# EAGLE design PC060HA (EAGLE 9.6.2)
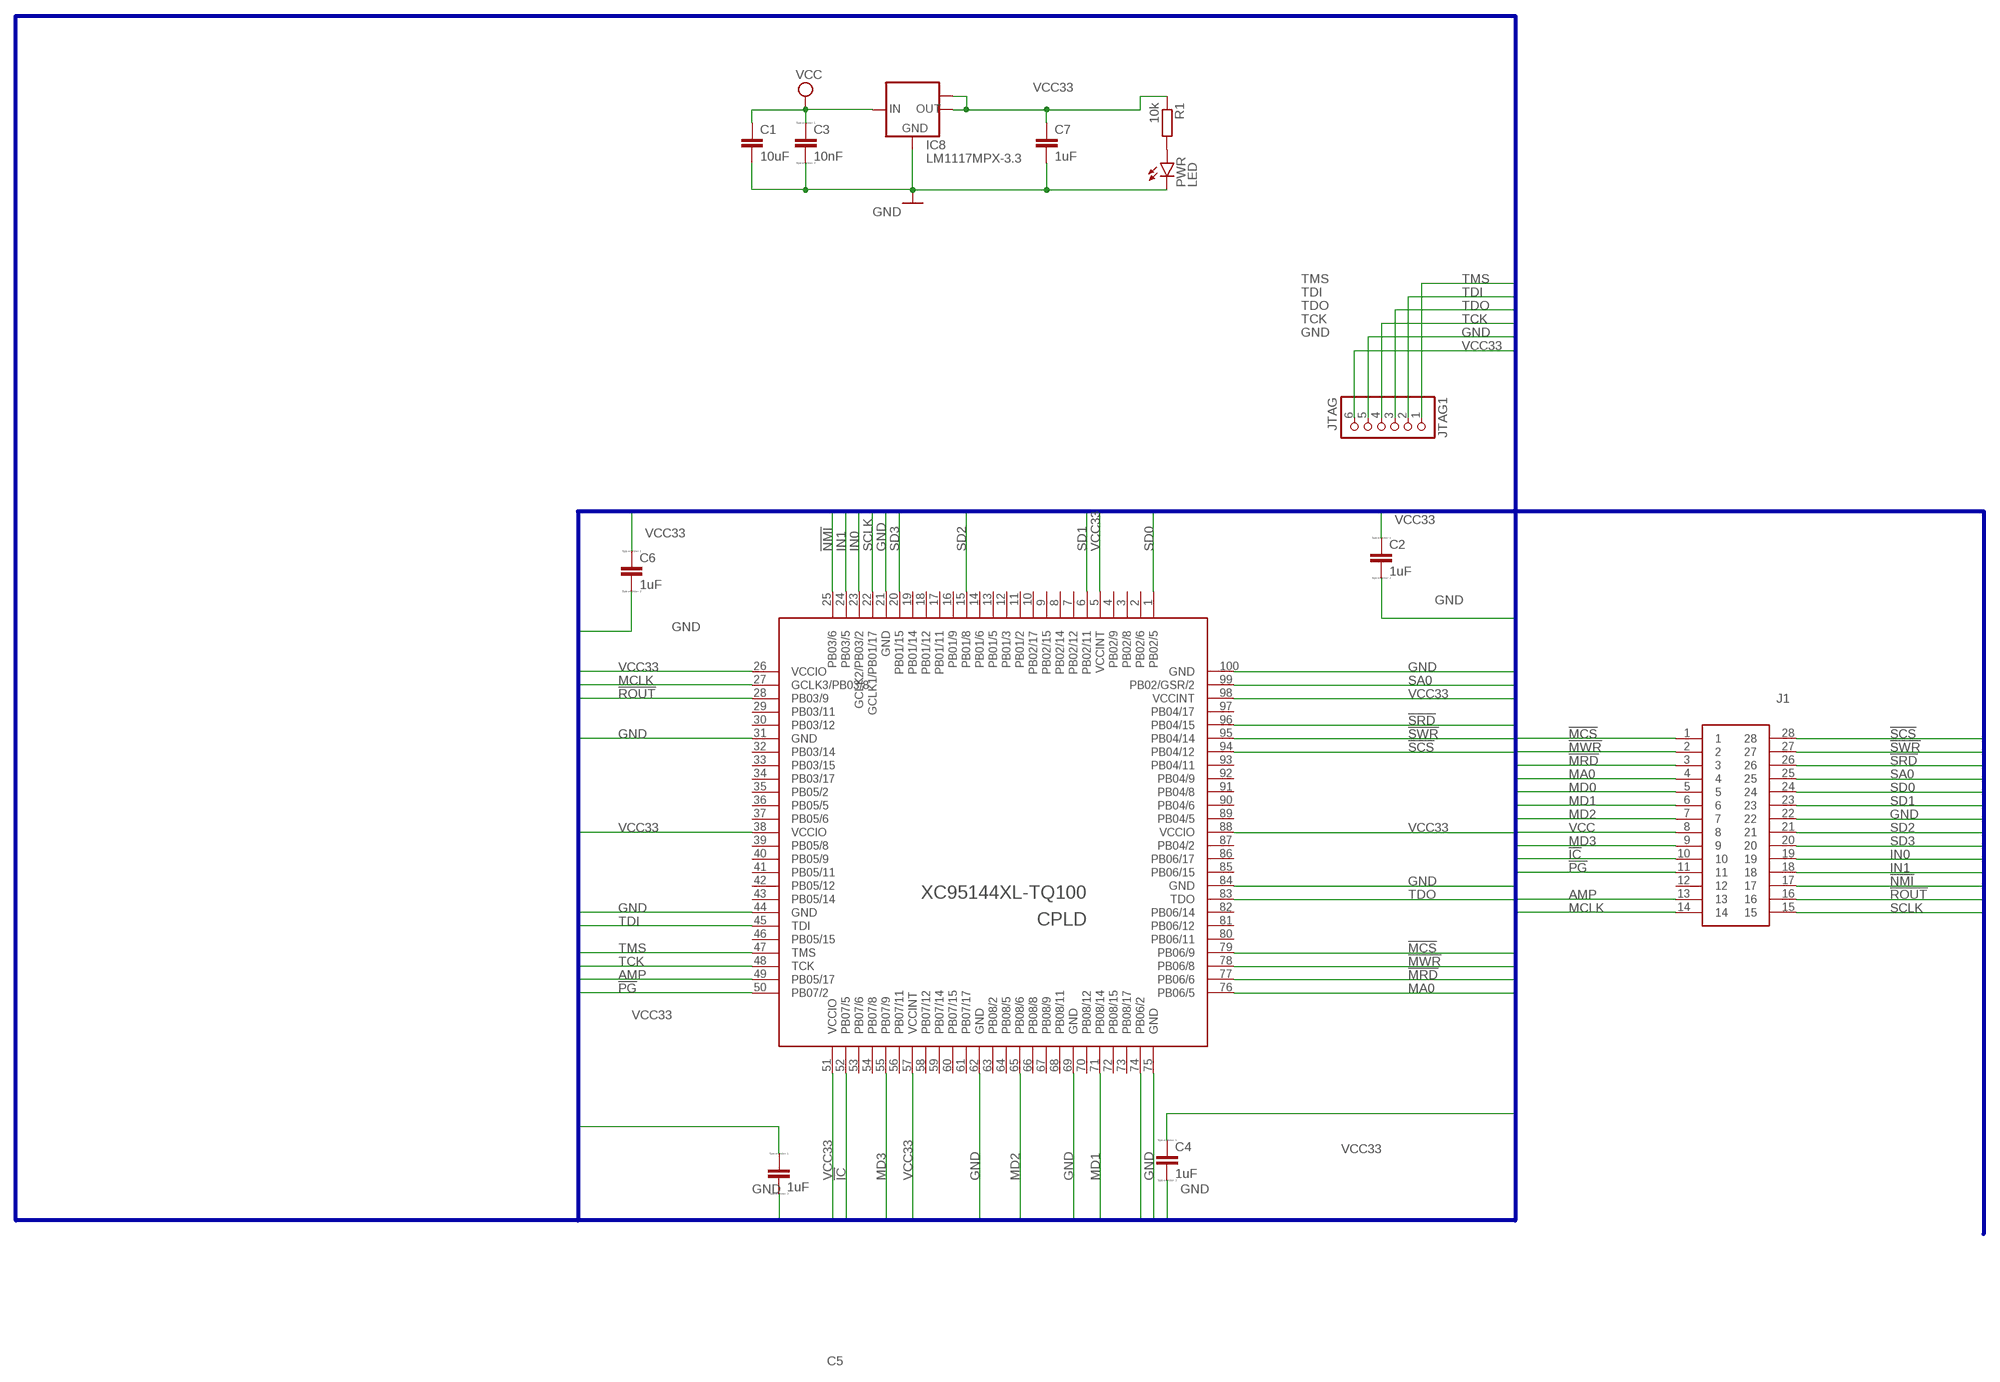
[diagram p0: schematic, sheet 1]

## Parts
C1  10uF  C-EUC1206  [C1206]
C2  1uF  CC0603  [C0603]
C3  10nF  CC0603  [C0603]
C4  1uF  CC0603  [C0603]
C5  1uF  CC0603  [C0603]
C6  1uF  CC0603  [C0603]
C7  1uF  C-EUC1206  [C1206]
CPLD  XC95144XL-TQ100  [TQFP100]
IC8  LM1117MPX-3.3  [SOT223]
J1  150-10-628-00-106161  [1501062800106161]
JTAG1  JTAG  HEADER-1X6ROUND  [1X06_ROUND]
PWR  LED  LEDSML0805  [SML0805]
R1  10k  R-EU_R0603  [R0603]

## Nets
!IC: CPLD.52(PB07/5) J1.10
!MCS: CPLD.79(PB06/9) J1.1
!MRD: CPLD.77(PB06/6) J1.3
!MWR: CPLD.78(PB06/8) J1.2
!NMI: CPLD.25(PB03/6) J1.17
!PG: CPLD.50(PB07/2) J1.11
!ROUT: CPLD.28(PB03/9) J1.16
!SCS: CPLD.94(PB04/12) J1.28
!SRD: CPLD.96(PB04/15) J1.26
!SWR: CPLD.95(PB04/14) J1.27
AMP: CPLD.49(PB05/17) J1.13
GND: C1.2 C2.2 C3.2 C4.2 C5.2 C6.2 C7.2 CPLD.21(GND) CPLD.31(GND) CPLD.44(GND) CPLD.62(GND) CPLD.69(GND) CPLD.75(GND) CPLD.84(GND) CPLD.100(GND) IC8.1(GND) J1.22 JTAG1.5 PWR.C
IN0: CPLD.23(GCLK2/PB03/2) J1.19
IN1: CPLD.24(PB03/5) J1.18
MA0: CPLD.76(PB06/5) J1.4
MCLK: CPLD.27(GCLK3/PB03/8) J1.14
MD0: CPLD.74(PB06/2) J1.5
MD1: CPLD.71(PB08/14) J1.6
MD2: CPLD.65(PB08/6) J1.7
MD3: CPLD.55(PB07/9) J1.9
N$18: PWR.A R1.2
SA0: CPLD.99(PB02/GSR/2) J1.25
SCLK: CPLD.22(GCLK1/PB01/17) J1.15
SD0: CPLD.1(PB02/5) J1.24
SD1: CPLD.6(PB02/11) J1.23
SD2: CPLD.15(PB01/8) J1.21
SD3: CPLD.20(PB01/15) J1.20
TCK: CPLD.48(TCK) JTAG1.4
TDI: CPLD.45(TDI) JTAG1.2
TDO: CPLD.83(TDO) JTAG1.3
TMS: CPLD.47(TMS) JTAG1.1
VCC: C1.1 C3.1 IC8.3(IN) J1.8
VCC33: C2.1 C4.1 C5.1 C6.1 C7.1 CPLD.5(VCCINT) CPLD.26(VCCIO) CPLD.38(VCCIO) CPLD.51(VCCIO) CPLD.57(VCCINT) CPLD.88(VCCIO) CPLD.98(VCCINT) IC8.2(OUT) IC8.TAB(OUT1) JTAG1.6 R1.1
Unconnected: CPLD.2(PB02/6) CPLD.3(PB02/8) CPLD.4(PB02/9) CPLD.7(PB02/12) CPLD.8(PB02/14) CPLD.9(PB02/15) CPLD.10(PB02/17) CPLD.11(PB01/2) CPLD.12(PB01/3) CPLD.13(PB01/5) CPLD.14(PB01/6) CPLD.16(PB01/9) CPLD.17(PB01/11) CPLD.18(PB01/12) CPLD.19(PB01/14) CPLD.29(PB03/11) CPLD.30(PB03/12) CPLD.32(PB03/14) CPLD.33(PB03/15) CPLD.34(PB03/17) CPLD.35(PB05/2) CPLD.36(PB05/5) CPLD.37(PB05/6) CPLD.39(PB05/8) CPLD.40(PB05/9) CPLD.41(PB05/11) CPLD.42(PB05/12) CPLD.43(PB05/14) CPLD.46(PB05/15) CPLD.53(PB07/6) CPLD.54(PB07/8) CPLD.56(PB07/11) CPLD.58(PB07/12) CPLD.59(PB07/14) CPLD.60(PB07/15) CPLD.61(PB07/17) CPLD.63(PB08/2) CPLD.64(PB08/5) CPLD.66(PB08/8) CPLD.67(PB08/9) CPLD.68(PB08/11) CPLD.70(PB08/12) CPLD.72(PB08/15) CPLD.73(PB08/17) CPLD.80(PB06/11) CPLD.81(PB06/12) CPLD.82(PB06/14) CPLD.85(PB06/15) CPLD.86(PB06/17) CPLD.87(PB04/2) CPLD.89(PB04/5) CPLD.90(PB04/6) CPLD.91(PB04/8) CPLD.92(PB04/9) CPLD.93(PB04/11) CPLD.97(PB04/17) J1.12

## Buses
AMP,GND,!IC,IN[0..1],MA0,MCLK,!MCS,MD[0..3],!MRD,!MWR,!NMI,!PG,!ROUT,SA0,SCLK,!SCS,SD[0..3],!SRD,!SWR,TCK,TDI,TDO,TMS,VCC,VCC33

## Library data of the parts
C1 C7 = rcl:C-EU: CAPACITOR, European symbol; SPICEPREFIX: C
C2-C6 = eagle-ltspice:C: CAPACITOR, European symbol; SPICEMODEL: NONE; SPICEPREFIX: C
CPLD = terriblefire:XC95144XL-TQ100
IC8 = lm1117:LM1117MPX-*
J1 = SamacSys_Parts:150-10-628-00-106161: CONN HDR DIP MALE PIN 28POS GOLD Source: Datasheet <https://www.precidip.com/AppHost/9698,1/Scripts/Modules/Catalog/Default.aspx?c=15&i=1473&p=334&pdf=1&dsku=150-PP-XXX-00-106161>; DESCRIPTION: CONN HDR DIP MALE PIN 28POS GOLD; HEIGHT: 8.4mm; MANUFACTURER_NAME: Preci-Dip; MANUFACTURER_PART_NUMBER: 150-10-628-00-106161
JTAG1 = microbuilder:HEADER-1X6: PIN HEADER
PWR = led:LED: LED OSRAM: - CHIPLED LG R971, LG N971, LY N971, LG Q971, LY Q971, LO R971, LY R971 LH N974, LH R974 LS Q976, LO Q976, LY Q976 LO Q996 - Hyper CHIPLED LW Q18S LB Q993, LB Q99A, LB R99A - SideLED LS A670, LO A670, LY A670, LG A670, LP A670 LB A673, LV A673, LT A673, LW A673 LH A674 LY A675 LS A676, LA A676, LO A676, LY A676, LW A676 LS A679, LY A679, LG A679 - Hyper Micro SIDELED® LS Y876, LA Y876, LO Y876, LY Y876 LT Y87S - SmartLED LW L88C, LW L88S LB L89C, LB L89S, LG L890 LS L89K, LO L89K, LY L89K LS L896, LA L896, LO L896, LY L896 - TOPLED LS T670, LO T670, LY T670, LG T670, LP T670 LSG T670, LSP T670, LSY T670, LOP T670, LYG T670 LG T671, LOG T671, LSG T671 LB T673, LV T673, LT T673, LW T673 LH T674 LS T676, LA T676, LO T676, LY T676, LB T676, LH T676, LSB T676, LW T676 LB T67C, LV T67C, LT T67C, LS T67K, LO T67K, LY T67K, LW E67C LS E67B, LA E67B, LO E67B, LY E67B, LB E67C, LV E67C, LT E67C LW T67C LS T679, LY T679, LG T679 LS T770, LO T770, LY T770, LG T770, LP T770 LB T773, LV T773, LT T773, LW T773 LH T774 LS E675, LA E675, LY E675, LS T675 LS T776, LA T776, LO T776, LY T776, LB T776 LHGB T686 LT T68C, LB T68C - Hyper Mini TOPLED® LB M676 - Mini TOPLED Santana® LG M470 LS M47K, LO M47K, LY M47K Source: http://www.osram.convergy.de LUXEON: - LUMILED® LXK2-PW12-R00, LXK2-PW12-S00, LXK2-PW14-U00, LXK2-PW14-V00 LXK2-PM12-R00, LXK2-PM12-S00, LXK2-PM14-U00 LXK2-PE12-Q00, LXK2-PE12-R00, LXK2-PE12-S00, LXK2-PE14-T00, LXK2-PE14-U00 LXK2-PB12-K00, LXK2-PB12-L00, LXK2-PB12-M00, LXK2-PB14-N00, LXK2-PB14-P00, LXK2-PB14-Q00 LXK2-PR12-L00, LXK2-PR12-M00, LXK2-PR14-Q00, LXK2-PR14-R00 LXK2-PD12-Q00, LXK2-PD12-R00, LXK2-PD12-S00 LXK2-PH12-R00, LXK2-PH12-S00 LXK2-PL12-P00, LXK2-PL12-Q00, LXK2-PL12-R00 Source: www.luxeon.com KINGBRIGHT: KA-3528ASYC Source: www.kingbright.com
R1 = rcl:R-EU_: RESISTOR, European symbol; SPICEPREFIX: R

## Board
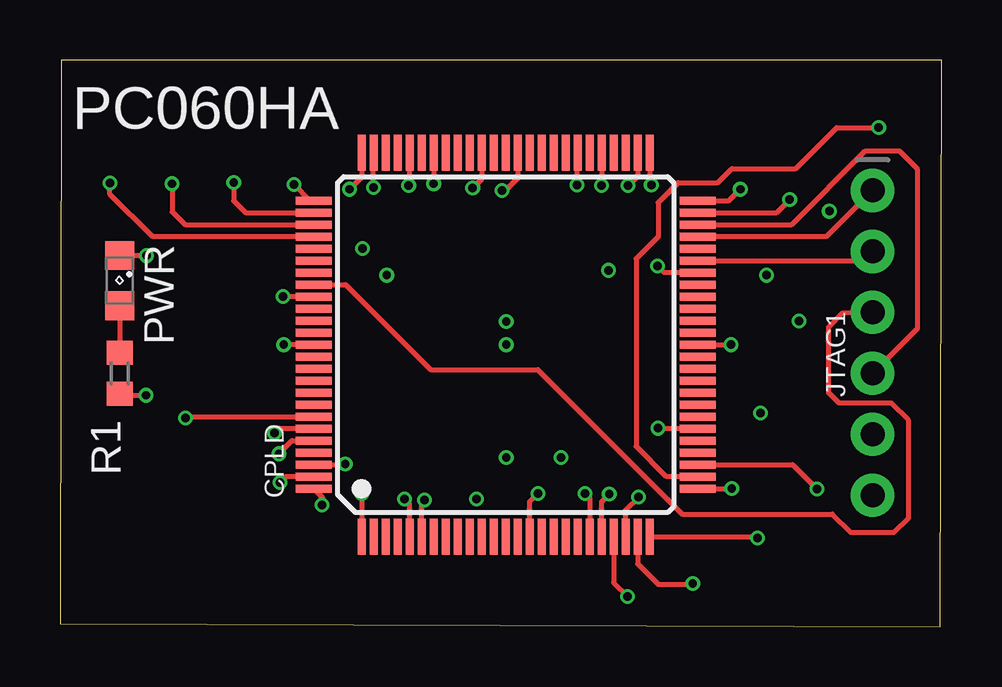
[diagram p1: board, top side]
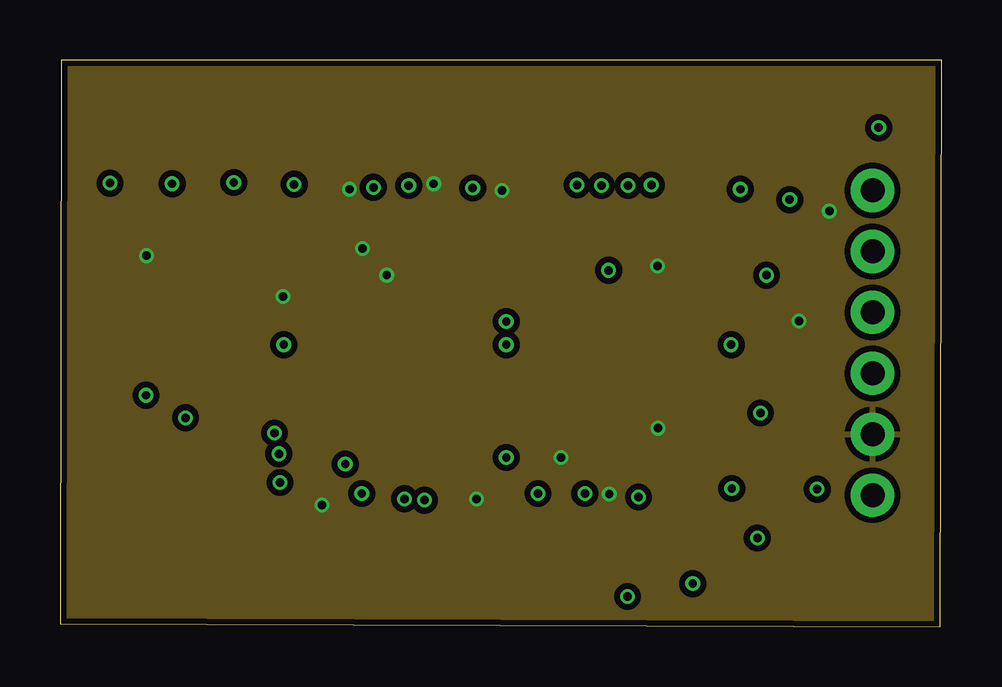
[diagram p2: board, inner layer Route2]
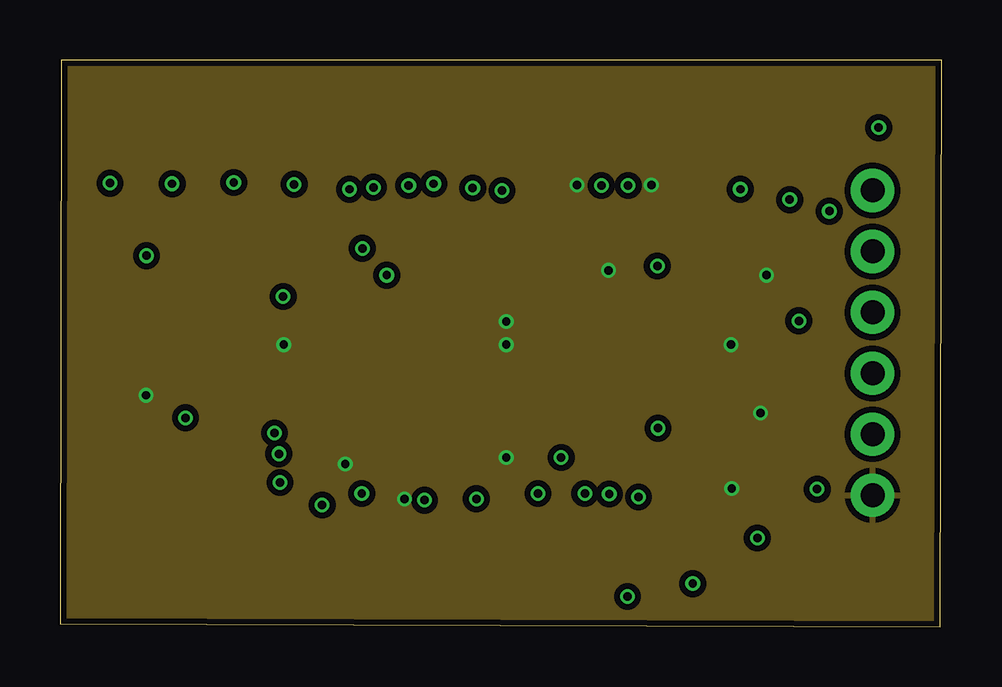
[diagram p3: board, inner layer Route15]
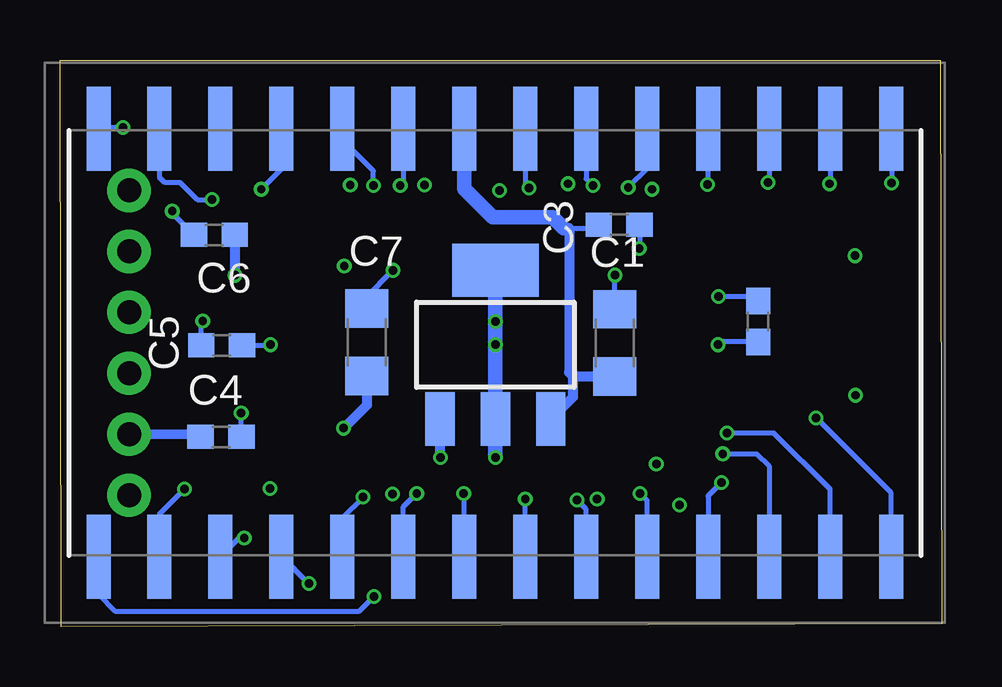
[diagram p4: board, bottom side, seen from below]

Size 36.73 x 23.62 mm. Coordinates in mm from the lower left corner, seen from the top.
Outline: 0,0.13 36.68,0 36.73,23.62 0.05,23.62 0,0.13
Copper layers (1+2*15+16): Top 0.035mm / dielectric 0.2mm / Route2 0.0175mm / dielectric 1.065mm / Route15 0.0175mm / dielectric 0.2mm / Bottom 0.035mm
Design rules "jlcpcb-4layers *": minimum track width 3.5mil, minimum drill 0.2mm, track to track 7mil, track to pad 7mil, pad to pad 6mil, via to via 7mil, smd to smd 7mil, copper to edge 0.2mm, drill to drill 7mil, minimum pad ring 10mil, minimum via ring 0.13mm, stop-mask expansion 0.05mm, vias tented up to drill 16mil, thermal gap 10mil

### Footprints (pad centres in the part's own frame; a part is rotated, then mirrored left to right if it is on the bottom)
C1206 = smd 1.6 x 1.8: 1 -1.4,0; 2 1.4,0
C0603 = smd 1.1 x 1: 1 -0.85,0; 2 0.85,0
TQFP100 = smd 1.5 x 0.34: 1 -8,6; 2 -8,5.5; 3 -8,5; 4 -8,4.5; 5 -8,4; 6 -8,3.5; 7 -8,3; 8 -8,2.5; 9 -8,2; 10 -8,1.5; 11 -8,1; 12 -8,0.5; 13 -8,0; 14 -8,-0.5; 15 -8,-1; 16 -8,-1.5; 17 -8,-2; 18 -8,-2.5; 19 -8,-3; 20 -8,-3.5; 21 -8,-4; 22 -8,-4.5; 23 -8,-5; 24 -8,-5.5; 25 -8,-6; 51 8,-6; 52 8,-5.5; 53 8,-5; 54 8,-4.5; 55 8,-4; 56 8,-3.5; 57 8,-3; 58 8,-2.5; 59 8,-2; 60 8,-1.5; 61 8,-1; 62 8,-0.5; 63 8,0; 64 8,0.5; 65 8,1; 66 8,1.5; 67 8,2; 68 8,2.5; 69 8,3; 70 8,3.5; 71 8,4; 72 8,4.5; 73 8,5; 74 8,5.5; 75 8,6 | smd 0.34 x 1.5: 26 -6,-8; 27 -5.5,-8; 28 -5,-8; 29 -4.5,-8; 30 -4,-8; 31 -3.5,-8; 32 -3,-8; 33 -2.5,-8; 34 -2,-8; 35 -1.5,-8; 36 -1,-8; 37 -0.5,-8; 38 0,-8; 39 0.5,-8; 40 1,-8; 41 1.5,-8; 42 2,-8; 43 2.5,-8; 44 3,-8; 45 3.5,-8; 46 4,-8; 47 4.5,-8; 48 5,-8; 49 5.5,-8; 50 6,-8; 76 6,8; 77 5.5,8; 78 5,8; 79 4.5,8; 80 4,8; 81 3.5,8; 82 3,8; 83 2.5,8; 84 2,8; 85 1.5,8; 86 1,8; 87 0.5,8; 88 0,8; 89 -0.5,8; 90 -1,8; 91 -1.5,8; 92 -2,8; 93 -2.5,8; 94 -3,8; 95 -3.5,8; 96 -4,8; 97 -4.5,8; 98 -5,8; 99 -5.5,8; 100 -6,8
SOT223 = smd 1.219 x 2.235: 1 -2.311,-3.099; 2 0,-3.099; 3 2.311,-3.099 | smd 3.6 x 2.2: TAB 0,3.099
1501062800106161 = smd 3.5 x 1: 1 -8.92,16.51; 2 -8.92,13.97; 3 -8.92,11.43; 4 -8.92,8.89; 5 -8.92,6.35; 6 -8.92,3.81; 7 -8.92,1.27; 8 -8.92,-1.27; 9 -8.92,-3.81; 10 -8.92,-6.35; 11 -8.92,-8.89; 12 -8.92,-11.43; 13 -8.92,-13.97; 14 -8.92,-16.51; 15 8.92,-16.51; 16 8.92,-13.97; 17 8.92,-11.43; 18 8.92,-8.89; 19 8.92,-6.35; 20 8.92,-3.81; 21 8.92,-1.27; 22 8.92,1.27; 23 8.92,3.81; 24 8.92,6.35; 25 8.92,8.89; 26 8.92,11.43; 27 8.92,13.97; 28 8.92,16.51
1X06_ROUND = drill 1 pad 1.676: 1 -6.35,0; 2 -3.81,0; 3 -1.27,0; 4 1.27,0; 5 3.81,0; 6 6.35,0
SML0805 = smd 1.2 x 1.2: A 1.05,0; C -1.05,0
R0603 = smd 1 x 1.1: 1 -0.85,0; 2 0.85,0

### Placement (x,y rotation side)
C1  13.61,11.84 90 bottom
C2  7.65,12.73 90 bottom
C3  13.44,16.76 0 bottom
C4  30.02,7.92 180 bottom
C5  30,11.73 180 bottom
C6  30.3,16.33 180 bottom
C7  23.95,11.86 270 bottom
CPLD  18.57,11.76 90 top
IC8  18.59,11.76 0 bottom
J1  18.62,11.84 270 bottom
JTAG1  33.86,11.84 270 top
PWR  2.49,14.43 270 top
R1  2.49,10.57 90 top

### Tracks (layer width: path | path; a pad name or v marks a point on that pad's centre or on a via)
!IC  (via drill 0.35)
  Top 0.203: CPLD.52 24.07,18.78 v23.67,18.39
  Bottom 0.203: v23.67,18.39 23.67,19 24.97,20.29 J1.10
!MCS  (via drill 0.35)
  Top 0.203: CPLD.79 3.86,16.26 2.08,18.03 v2.08,18.49
  Bottom 0.203: J1.1 2.08,20.73 v2.08,18.49
!MRD  (via drill 0.35)
  Top 0.203: v7.24,18.52 7.24,17.75 7.73,17.26 CPLD.77
  Bottom 0.203: J1.3 7.19,18.57 v7.24,18.52
!MWR  (via drill 0.35)
  Top 0.203: v4.67,18.47 4.67,17.3 5.21,16.76 CPLD.78
  Bottom 0.203: J1.2 4.65,18.49 v4.67,18.47
!NMI  (via drill 0.35)
  Top 0.203: CPLD.25 29.01,3.76 v29.06,3.71
  Bottom 0.203: v29.06,3.71 29.26,3.71 J1.17
!PG  (via drill 0.35)
  Top 0.203: CPLD.50 27.87,17.76 v28.35,18.24
  Bottom 0.203: v28.35,18.24 27.51,19.07 J1.11
!ROUT  (via drill 0.35)
  Top 0.203: CPLD.28 30.53,6.76 v31.55,5.74
  Bottom 0.203: v31.55,5.74 32.59,4.7 J1.16
!SCS  (via drill 0.35)
  Top 0.203: v5.23,8.71 5.28,8.76 CPLD.94
  Bottom 0.203: J1.28 2.11,5.59 v5.23,8.71
!SRD  (via drill 0.35)
  Top 0.203: v9.12,7.21 9.66,7.76 CPLD.96
  Bottom 0.203: v9.12,7.21 7.7,7.21 7.19,6.71 J1.26
!SWR  (via drill 0.35)
  Top 0.203: CPLD.95 9.12,8.26 v8.94,8.08
  Bottom 0.203: J1.27 4.65,5.74 6.99,8.08 v8.94,8.08
AMP  (via drill 0.35)
  Top 0.203: CPLD.49 29.86,17.26 v30.4,17.8
  Bottom 0.203: J1.13 32.59,18.74 32.36,18.52 31.73,18.52 31.01,17.8 v30.4,17.8
GND  (via drill 0.35)
  Top 0.203: CPLD.31 24.94,8.26 v24.92,8.28 | CPLD.44 25.17,14.76 v24.89,15.04 | CPLD.84 v9.3,13.76 v9.3,13.77 | CPLD.75 12.57,18.74 v12.06,18.24 | CPLD.69 v15.57,18.47 | CPLD.62 19.07,18.69 18.57,18.19 v18.41,18.19 | CPLD.100 10.92,5.41 v10.92,5.08 | CPLD.21 22.57,5.22 v22.89,5.54 | PWR.C 3.6,15.48 v3.61,15.47
  Bottom 0.203: J1.22 v17.35,5.33 | C5.2 30.85,12.69 v30.79,12.75 | v32.05,17.32 32.05,17.23 C6.2 | C1.2 v13.61,14.66 | C3.2 12.59,15.79 v12.6,15.77 | C2.2 7.84,13.77 v9.3,13.77
  Bottom 0.406: IC8.1 20.9,7.09 v20.88,7.06 | C7.2 23.95,9.25 v24.92,8.28 | C4.2 30.95,8 JTAG1.5
  pour Route2 (isolate 0.254): 0,23.42 0,0.13 36.68,0 36.68,23.42
IN0  (via drill 0.35)
  Top 0.203: CPLD.23 23.57,4.87 v24.11,5.41
  Bottom 0.203: J1.19 24.97,4.55 v24.11,5.41
IN1  (via drill 0.35)
  Top 0.203: CPLD.24 24.07,2.63 24.92,1.78 26.34,1.78 v26.36,1.8
  Bottom 0.203: v26.36,1.8 27.48,2.92 J1.18
MA0  (via drill 0.35)
  Top 0.203: CPLD.76 10.43,17.76 v9.75,18.44
  Bottom 0.203: J1.4 9.75,20.73 v9.75,18.44
MCLK  (via drill 0.35)
  Top 0.203: CPLD.27 25.26,6.26 24,7.52 24,15.34 24.92,16.26 24.92,17.68 25.76,18.52 27.41,18.52 27.99,19.1 30.66,19.1 32.36,20.8 v34.11,20.8
  Bottom 0.203: v34.11,20.8 35.08,20.8 J1.14
MD0  (via drill 0.35)
  Top 0.203: v13.06,18.31 13.06,19.75 CPLD.74
  Bottom 0.203: J1.5 12.27,19.1 v13.06,18.31
MD1  (via drill 0.35)
  Top 0.203: v14.53,18.39 14.57,18.43 CPLD.71
  Bottom 0.203: J1.6 14.81,18.67 v14.53,18.39
MD2  (via drill 0.35)
  Top 0.203: CPLD.65 17.57,18.66 v17.2,18.29
  Bottom 0.203: J1.7 17.35,18.44 v17.2,18.29
MD3  (via drill 0.35)
  Top 0.203: CPLD.55 22.57,18.4 v22.55,18.39
  Bottom 0.203: J1.9 22.43,18.52 v22.55,18.39
N$18
  Top 0.203: PWR.A R1.2
SA0  (via drill 0.35)
  Top 0.203: CPLD.99 9.41,6.26 v9.17,6.02
  Bottom 0.203: v9.17,6.02 9.73,5.46 J1.25
SCLK  (via drill 0.35)
  Top 0.203: CPLD.22 23.07,1.85 v23.65,1.27
  Bottom 0.203: J1.15 35.13,1.35 34.44,0.66 24.26,0.66 v23.65,1.27
SD0  (via drill 0.35)
  Top 0.203: v12.57,5.56 CPLD.1
  Bottom 0.203: J1.24 12.27,5.26 v12.57,5.56
SD1  (via drill 0.35)
  Top 0.203: CPLD.6 15.07,5.16 v15.19,5.28
  Bottom 0.203: J1.23 14.81,4.9 v15.19,5.28
SD2  (via drill 0.35)
  Top 0.203: CPLD.15 19.57,5.22 v19.91,5.56
  Bottom 0.203: v19.91,5.56 19.91,2.94 J1.21
SD3  (via drill 0.35)
  Top 0.203: v21.87,5.56 22.07,5.37 CPLD.20
  Bottom 0.203: J1.20 22.43,5 v21.87,5.56
TCK
  Top 0.203: CPLD.48 30.48,16.76 33.56,19.84 34.98,19.84 35.71,19.1 35.71,12.42 JTAG1.4
TDI
  Top 0.203: JTAG1.2 33.47,15.26 CPLD.45
TDO
  Top 0.203: CPLD.83 11.9,14.26 15.44,10.72 19.91,10.72 25.93,4.7 32.18,4.7 32.94,3.94 34.75,3.94 35.36,4.55 35.36,8.61 34.65,9.32 32.46,9.32 32.03,9.75 32.03,12.5 32.61,13.08 JTAG1.3
TMS
  Top 0.203: JTAG1.1 31.93,16.26 CPLD.47
VCC
  Bottom 0.203: 15.75,16.61 15.52,16.61 14.44,16.61 C3.1
  Bottom 0.406: 15.52,16.61 15.52,10.59 15.36,10.44 | 15.36,10.44 C1.1 | 15.36,10.44 15.36,9.58 IC8.3
  Bottom 0.61: J1.8 19.89,18.26 18.69,17.07 16.2,17.07 15.75,16.61
VCC33  (via drill 0.35)
  Top 0.203: CPLD.5 14.57,5.12 v14.35,5.33 | CPLD.38 v27.96,11.76 | CPLD.57 21.54,19.73 v21.54,18.41 | CPLD.88 v9.32,11.76 | CPLD.98 11.87,6.76 v11.89,6.78 | CPLD.26 v27.98,5.76 v27.99,5.77 | CPLD.51 24.57,18.49 v24.64,18.41 | R1.1 2.55,9.65 v3.58,9.65
  Bottom 0.203: C7.1 23.95,13.77 v22.86,14.86 | C5.1 27.99,11.74 v27.96,11.76 | C4.1 29.17,8.9 v29.18,8.92 | 18.59,8.71 IC8.2 18.59,8.53 | 18.59,14.73 IC8.TAB 18.59,15.06 | C2.1 9.21,11.88 v9.32,11.76
  Bottom 0.406: C6.1 29.45,14.67 v29.44,14.66
  Bottom 0.61: 18.59,14.73 v18.59,11.76 18.59,8.71 | 18.59,15.06 v18.59,12.73 | v18.59,7.06 18.59,8.53
  pour Route15 (isolate 0.254, rank 2): 0,23.49 0,0.13 36.68,0 36.68,23.54

### Text on the board
tNames: PC060HA